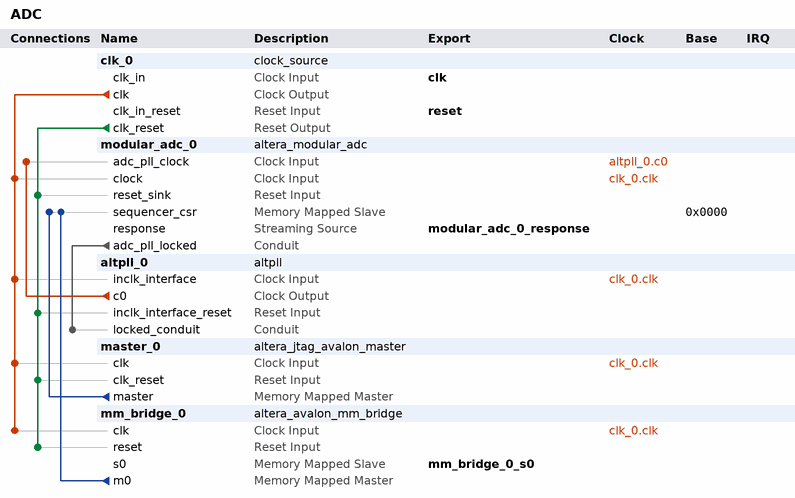
[diagram p0: system contents]
# Platform Designer (Qsys) system ADC, MAX 10 10M50DAF484C6GES
# Parameters at their usual value, and those the tool derives, are not listed.
package require -exact qsys 23.1
create_system ADC
set_project_property DEVICE_FAMILY {MAX 10}
set_project_property DEVICE 10M50DAF484C6GES

add_instance clk_0 clock_source 23.1
set_instance_parameter_value clk_0 clockFrequency 50000000

add_instance modular_adc_0 altera_modular_adc 23.1
set_instance_parameter_value modular_adc_0 CLOCK_FREQ 50000000
set_instance_parameter_value modular_adc_0 CORE_VAR 2
set_instance_parameter_value modular_adc_0 DEVICE_PART 10M50DAF484C6GES
set_instance_parameter_value modular_adc_0 ENABLE_DEBUG 1
set_instance_parameter_value modular_adc_0 clkdiv 2
set_instance_parameter_value modular_adc_0 int_vref_vr 3.0
set_instance_parameter_value modular_adc_0 refsel 0
set_instance_parameter_value modular_adc_0 sample_rate 0
set_instance_parameter_value modular_adc_0 seq_order_length 1
set_instance_parameter_value modular_adc_0 seq_order_slot_1 1
set_instance_parameter_value modular_adc_0 seq_order_slot_2 30
set_instance_parameter_value modular_adc_0 seq_order_slot_3 30
set_instance_parameter_value modular_adc_0 seq_order_slot_4 30
set_instance_parameter_value modular_adc_0 seq_order_slot_5 30
set_instance_parameter_value modular_adc_0 seq_order_slot_6 30
set_instance_parameter_value modular_adc_0 seq_order_slot_7 30
set_instance_parameter_value modular_adc_0 use_ch0 false
set_instance_parameter_value modular_adc_0 use_ch2 false
set_instance_parameter_value modular_adc_0 use_ch3 false
set_instance_parameter_value modular_adc_0 use_ch4 false
set_instance_parameter_value modular_adc_0 use_ch5 false
set_instance_parameter_value modular_adc_0 use_ch6 false
set_instance_parameter_value modular_adc_0 use_ch7 false
set_instance_parameter_value modular_adc_0 use_ch8 false
set_instance_parameter_value modular_adc_0 use_tsd false

add_instance altpll_0 altpll 23.1
set_instance_parameter_value altpll_0 CLK0_DIVIDE_BY 1
set_instance_parameter_value altpll_0 CLK0_MULTIPLY_BY 1
set_instance_parameter_value altpll_0 INCLK0_INPUT_FREQUENCY 100000
set_instance_parameter_value altpll_0 PORT_ARESET PORT_USED
set_instance_parameter_value altpll_0 PORT_LOCKED PORT_USED
set_instance_parameter_value altpll_0 PORT_clk1 PORT_UNUSED
set_instance_parameter_value altpll_0 PORT_clk2 PORT_UNUSED
set_instance_parameter_value altpll_0 PORT_clk3 PORT_UNUSED

add_instance master_0 altera_jtag_avalon_master 23.1

add_instance mm_bridge_0 altera_avalon_mm_bridge 23.1
set_instance_parameter_value mm_bridge_0 ADDRESS_UNITS SYMBOLS
set_instance_parameter_value mm_bridge_0 ADDRESS_WIDTH 10
set_instance_parameter_value mm_bridge_0 DATA_WIDTH 16
set_instance_parameter_value mm_bridge_0 MAX_PENDING_RESPONSES 4
set_instance_parameter_value mm_bridge_0 USE_AUTO_ADDRESS_WIDTH 0

# connections
add_connection altpll_0.c0 modular_adc_0.adc_pll_clock clock
add_connection clk_0.clk altpll_0.inclk_interface clock
add_connection clk_0.clk master_0.clk clock
add_connection clk_0.clk mm_bridge_0.clk clock
add_connection clk_0.clk modular_adc_0.clock clock
add_connection clk_0.clk_reset altpll_0.inclk_interface_reset reset
add_connection clk_0.clk_reset master_0.clk_reset reset
add_connection clk_0.clk_reset mm_bridge_0.reset reset
add_connection clk_0.clk_reset modular_adc_0.reset_sink reset
add_connection master_0.master modular_adc_0.sequencer_csr avalon
set_connection_parameter_value master_0.master/modular_adc_0.sequencer_csr baseAddress 0x0000
add_connection mm_bridge_0.m0 modular_adc_0.sequencer_csr avalon
set_connection_parameter_value mm_bridge_0.m0/modular_adc_0.sequencer_csr baseAddress 0x0000
add_connection modular_adc_0.adc_pll_locked altpll_0.locked_conduit conduit

# exported interfaces
add_interface clk clock sink
set_interface_property clk EXPORT_OF clk_0.clk_in
add_interface mm_bridge_0_s0 avalon slave
set_interface_property mm_bridge_0_s0 EXPORT_OF mm_bridge_0.s0
add_interface modular_adc_0_response avalon_streaming source
set_interface_property modular_adc_0_response EXPORT_OF modular_adc_0.response
add_interface reset reset sink
set_interface_property reset EXPORT_OF clk_0.clk_in_reset

set_interconnect_requirement {$system} qsys_mm.clockCrossingAdapter HANDSHAKE
set_interconnect_requirement {$system} qsys_mm.enableEccProtection FALSE
set_interconnect_requirement {$system} qsys_mm.insertDefaultSlave FALSE
set_interconnect_requirement {$system} qsys_mm.maxAdditionalLatency 1

save_system ADC.qsys
